# EAGLE schematic 1420-1 (EAGLE 6.0)
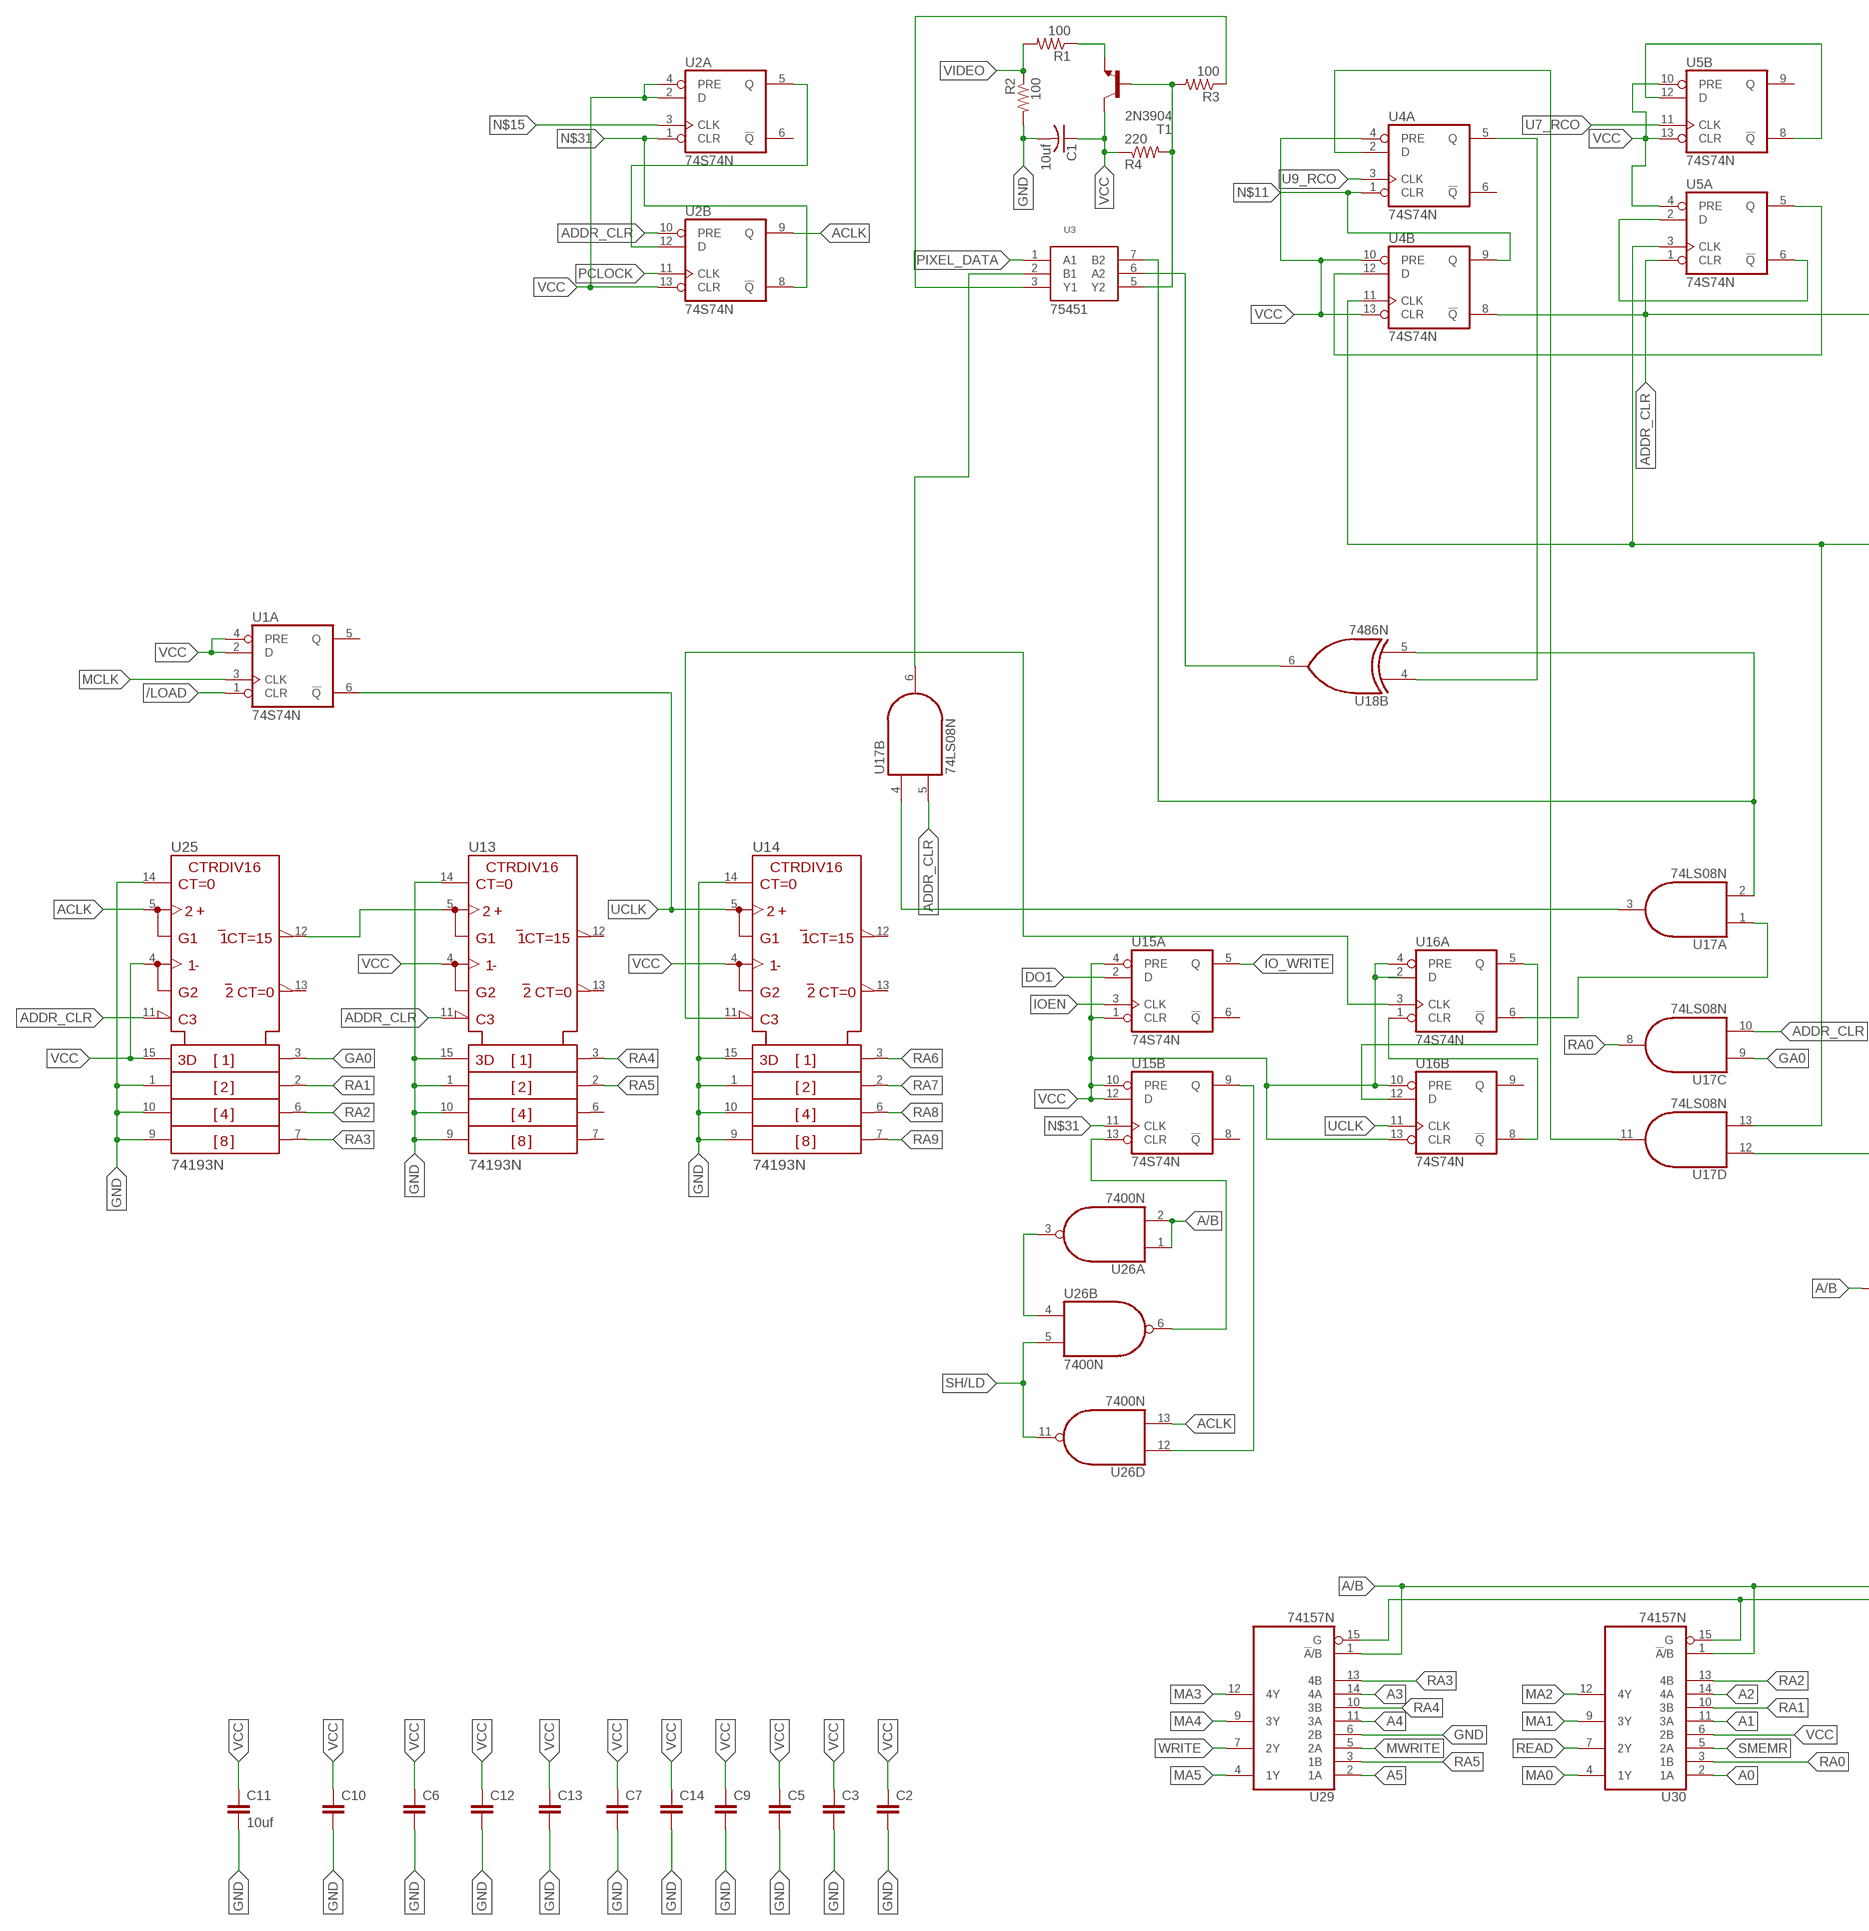
[diagram p0: schematic, sheet 1, part 1 of 2]
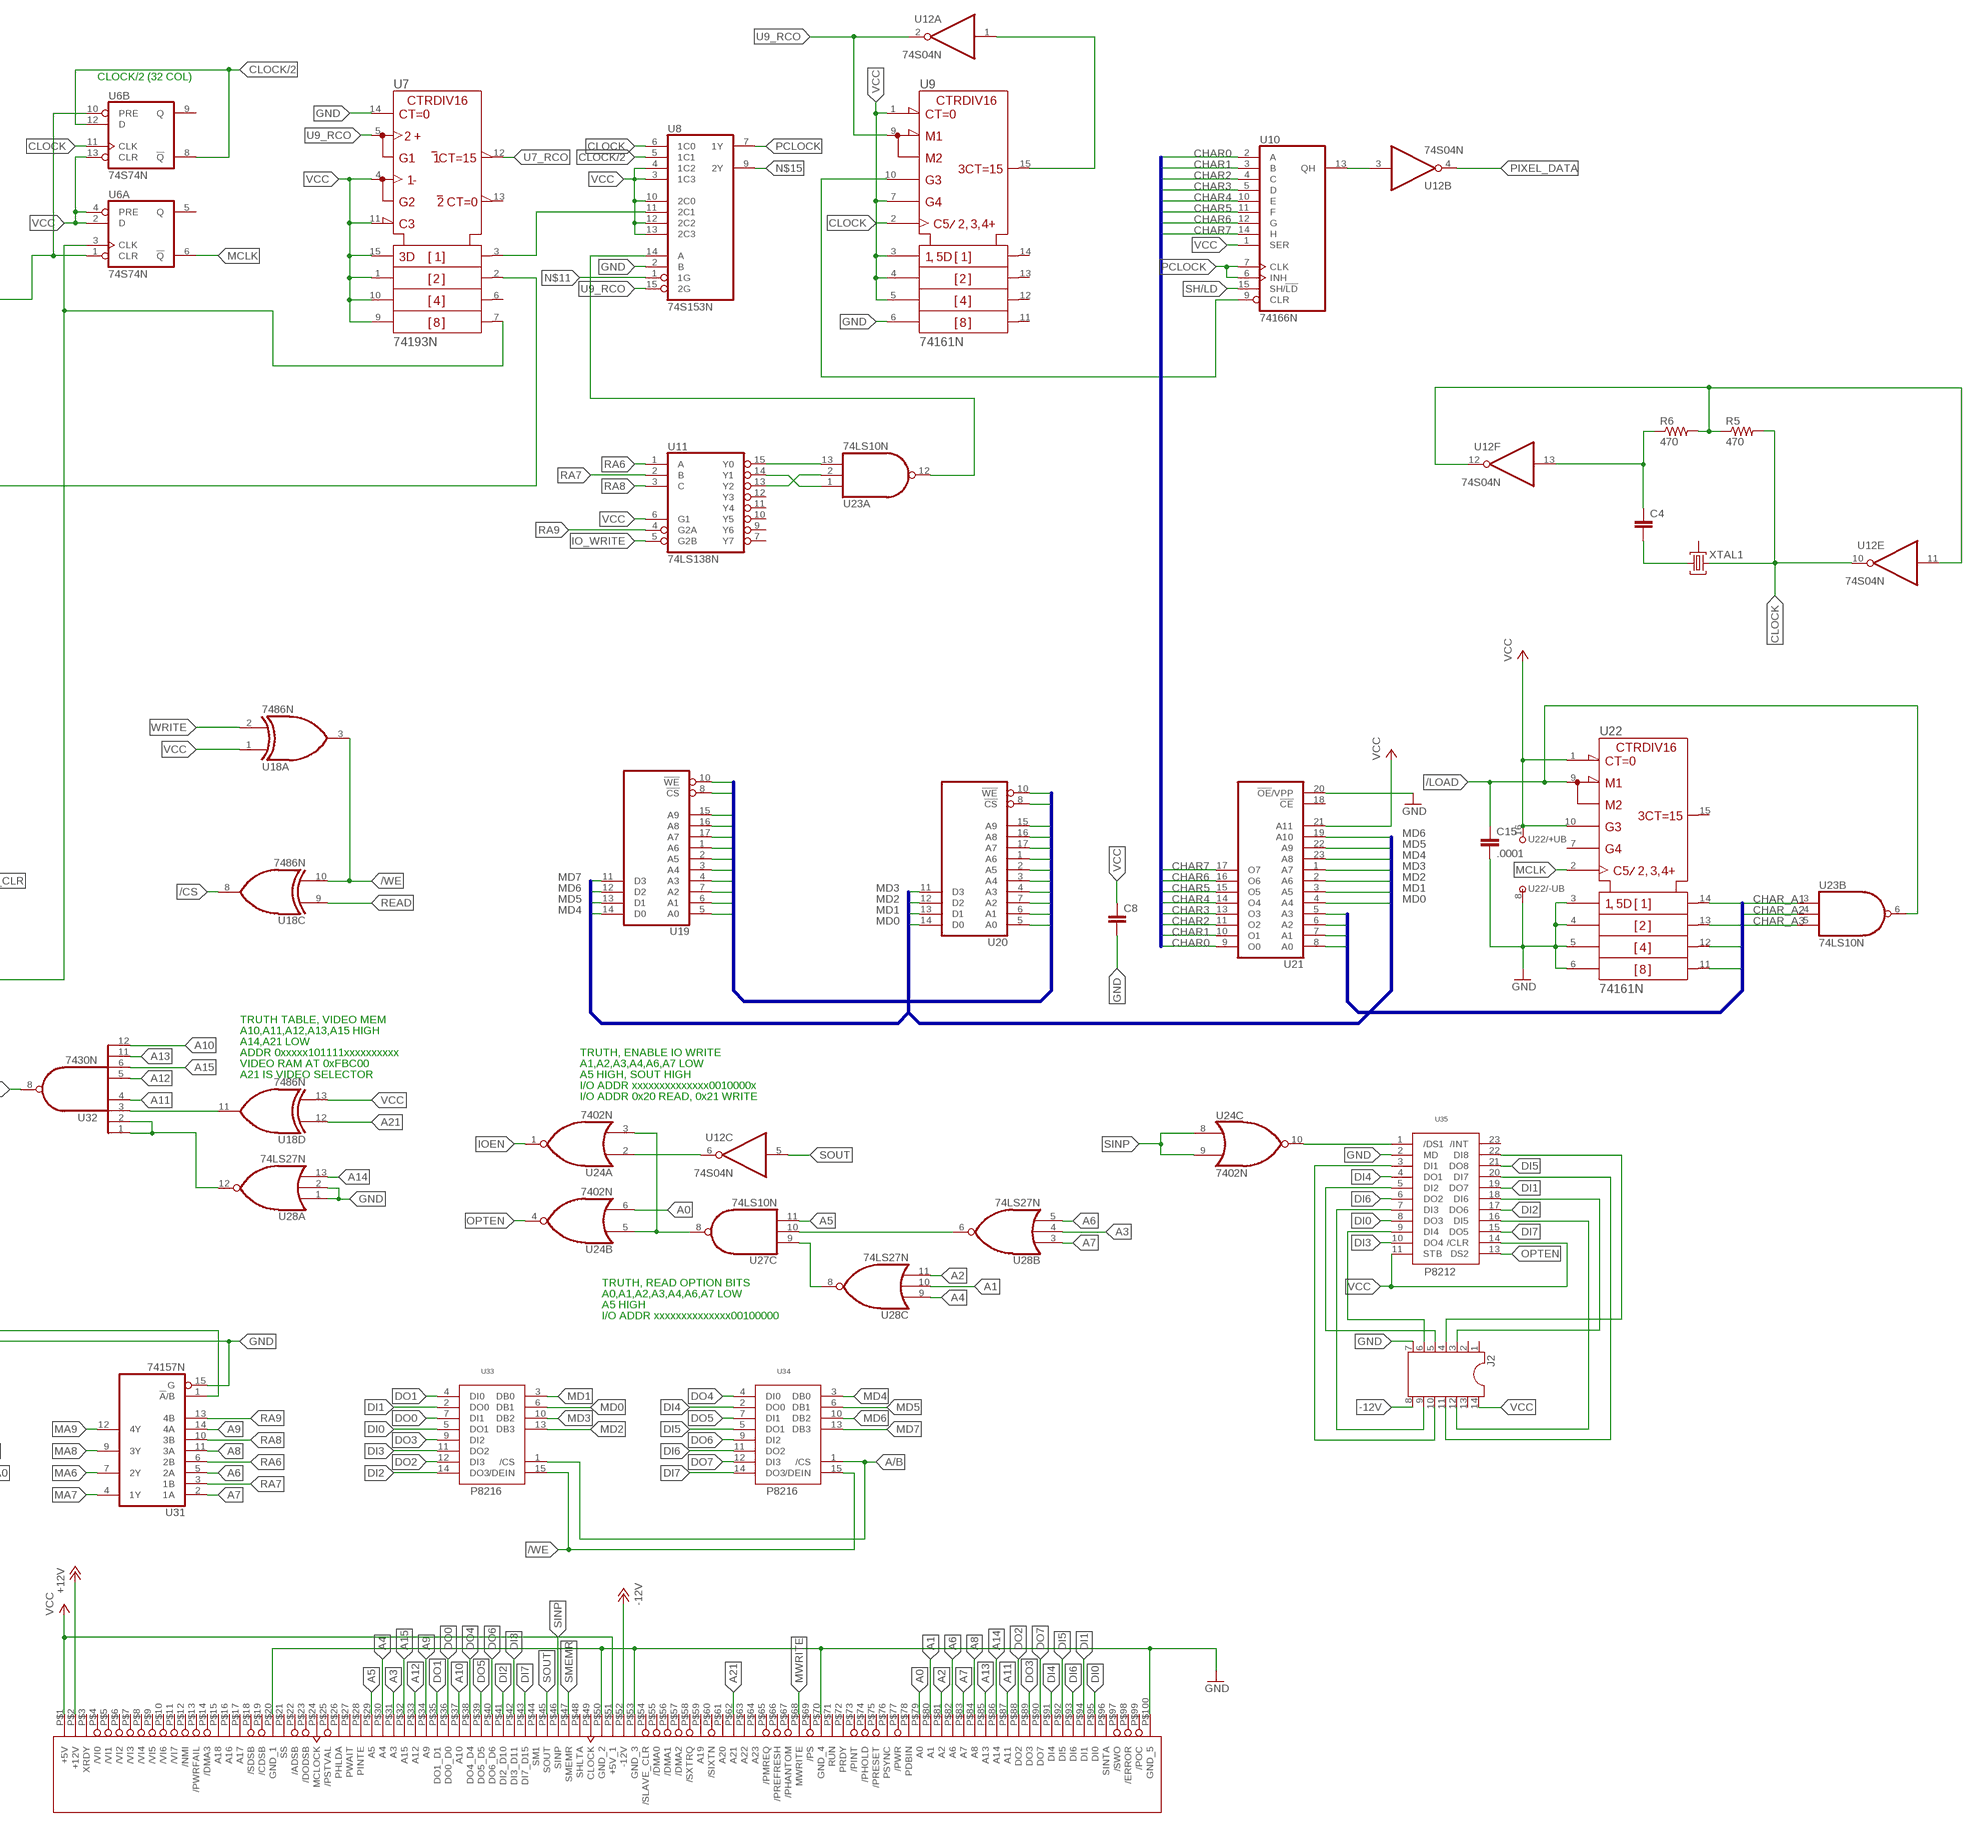
[diagram p1: schematic, sheet 1, part 2 of 2]

## Parts
C1  10uf  C-US075-042X103  [C075-042X103]
C2  C7.5/3  [C7.5B3]
C3  C7.5/3  [C7.5B3]
C4  C7.5/3  [C7.5B3]
C5  C7.5/3  [C7.5B3]
C6  C7.5/3  [C7.5B3]
C7  C7.5/3  [C7.5B3]
C8  C7.5/3  [C7.5B3]
C9  C7.5/3  [C7.5B3]
C10  C7.5/3  [C7.5B3]
C11  10uf  C7.5/3  [C7.5B3]
C12  C7.5/3  [C7.5B3]
C13  C7.5/3  [C7.5B3]
C14  C7.5/3  [C7.5B3]
C15  .0001  C7.5/3  [C7.5B3]
J2  DIL14S  [SOCKET-14]
R1  100  R-US_0207/15  [0207/15]
R2  100  R-US_0207/15  [0207/15]
R3  100  R-US_0207/15  [0207/15]
R4  220  R-US_0207/15  [0207/15]
R5  470  R-US_0207/15  [0207/15]
R6  470  R-US_0207/15  [0207/15]
T1  2N3904  [TO92]
U1  74S74N  [DIL14]
U2  74S74N  [DIL14]
U3  75451  [DIL08]
U4  74S74N  [DIL14]
U5  74S74N  [DIL14]
U6  74S74N  [DIL14]
U7  74193N  [DIL16]
U8  74S153N  [DIL16]
U9  74161N  [DIL16]
U10  74166N  [DIL16]
U11  74LS138N  [DIL16]
U12  74S04N  [DIL14]
U13  74193N  [DIL16]
U14  74193N  [DIL16]
U15  74S74N  [DIL14]
U16  74S74N  [DIL14]
U17  74LS08N  [DIL14]
U18  7486N  [DIL14]
U19  2114  [DIL18]
U20  2114  [DIL18]
U21  2732  [DIL24]
U22  74161N  [DIL16]
U23  74LS10N  [DIL14]
U24  7402N  [DIL14]
U25  74193N  [DIL16]
U26  7400N  [DIL14]
U27  74LS10N  [DIL14]
U28  74LS27N  [DIL14]
U29  74157N  [DIL16]
U30  74157N  [DIL16]
U31  74157N  [DIL16]
U32  7430N  [DIL14]
U33  P8216  [DIL16]
U34  P8216  [DIL16]
U35  P8212  [DIL24-6]
U$1  S100_MALE  [S100_MALE]
XTAL1  HC49TL-H  [HC49TL-H]

## Nets
+12V: U$1.P$2(+12V)
-12V: J2.8 U$1.P$52(-12V)
/A14: U28.12(A:O) U32.1(I0) U32.2(I1)
/CS: U18.8(C:O) U19.8(!CS) U20.8(!CS)
/LOAD: C15.1 U1.1(A:CLR) U22.9(!LOAD) U23.6(B:O)
/WE: U18.3(A:O) U18.10(C:I1) U18.11(D:O) U19.10(!WE) U20.10(!WE) U32.3(I2) U33.15(/DEIN) U34.15(/DEIN)
A0: U24.6(B:I1) U30.2(1A) U$1.P$79(A0)
A1: U28.10(C:I1) U30.11(3A) U$1.P$80(A1)
A2: U28.11(C:I2) U30.14(4A) U$1.P$81(A2)
A3: U28.4(B:I1) U29.14(4A) U$1.P$31(A3)
A4: U28.9(C:I0) U29.11(3A) U$1.P$30(A4)
A5: U27.11(C:I2) U29.2(1A) U$1.P$29(A5)
A6: U28.5(B:I2) U31.5(2A) U$1.P$82(A6)
A7: U28.3(B:I0) U31.2(1A) U$1.P$83(A7)
A8: U31.11(3A) U$1.P$84(A8)
A9: U31.14(4A) U$1.P$34(A9)
A10: U32.12(I7) U$1.P$37(A10)
A11: U32.4(I3) U$1.P$87(A11)
A12: U32.5(I4) U$1.P$33(A12)
A13: U32.11(I6) U$1.P$85(A13)
A14: U28.13(A:I2) U$1.P$86(A14)
A15: U32.6(I5) U$1.P$32(A15)
A21: U18.12(D:I0) U$1.P$62(A21)
A/B: U26.1(A:I0) U26.2(A:I1) U29.1(!A!/B) U30.1(!A!/B) U31.1(!A!/B) U32.8(O) U33.1(/CS) U34.1(/CS)
ACLK: U2.9(B:Q) U25.5(UP) U26.13(D:I1)
ADDR_CLR: U2.10(B:PRE) U4.8(B:!Q) U5.1(A:CLR) U6.1(A:CLR) U6.10(B:PRE) U13.11(!LOAD) U14.11(!LOAD) U16.3(A:CLK) U17.5(B:I1) U17.10(C:I1) U25.11(!LOAD)
CHAR0: U10.2(A) U21.9(O0)
CHAR1: U10.3(B) U21.10(O1)
CHAR2: U10.4(C) U21.11(O2)
CHAR3: U10.5(D) U21.13(O3)
CHAR4: U10.10(E) U21.14(O4)
CHAR5: U10.11(F) U21.15(O5)
CHAR6: U10.12(G) U21.16(O6)
CHAR7: U10.14(H) U21.17(O7)
CHAR_A0: U21.8(A0) U22.14(QA)
CHAR_A1: U21.7(A1) U22.13(QB) U23.3(B:I0)
CHAR_A2: U21.6(A2) U22.12(QC) U23.4(B:I1)
CHAR_A3: U21.5(A3) U22.11(QD) U23.5(B:I2)
CLOCK: R5.2 U6.11(B:CLK) U8.6(1C0) U9.2(CLK) U12.10(E:O) XTAL1.2
CLOCK/2: U6.8(B:!Q) U6.12(B:D) U8.5(1C1)
DI0: U33.5(DO1) U35.8(DO3) U$1.P$95(DI0)
DI1: U33.2(DO0) U35.19(DO7) U$1.P$94(DI1)
DI2: U33.14(DO3) U35.17(DO6) U$1.P$41(DI2_D10)
DI3: U33.11(DO2) U35.10(DO4) U$1.P$42(DI3_D11)
DI4: U34.2(DO0) U35.4(DO1) U$1.P$91(DI4)
DI5: U34.5(DO1) U35.21(DO8) U$1.P$92(DI5)
DI6: U34.11(DO2) U35.6(DO2) U$1.P$93(DI6)
DI7: U34.14(DO3) U35.15(DO5) U$1.P$43(DI7_D15)
DO0: U33.7(DI1) U$1.P$36(DO0_D0)
DO1: U15.2(A:D) U33.4(DI0) U$1.P$35(DO1_D1)
DO2: U33.12(DI3) U$1.P$88(DO2)
DO3: U33.9(DI2) U$1.P$89(DO3)
DO4: U34.4(DI0) U$1.P$38(DO4_D4)
DO5: U34.7(DI1) U$1.P$39(DO5_D5)
DO6: U34.9(DI2) U$1.P$40(DO6_D6)
DO7: U34.12(DI3) U$1.P$90(DO7)
GA0: U17.9(C:I0) U25.3(QA)
GND: C1.2 C2.2 C3.2 C5.2 C6.2 C7.2 C8.2 C9.2 C10.2 C11.2 C12.2 C13.2 C14.2 C15.2 J2.6 J2.7 R2.2 U7.14(CLR) U8.2(B) U9.6(D) U13.1(B) U13.9(D) U13.10(C) U13.14(CLR) U13.15(A) U14.1(B) U14.9(D) U14.10(C) U14.14(CLR) U14.15(A) U21.20(!OE!/VPP) U22.3(A) U22.4(B) U22.5(C) U22.6(D) U22.8(-UB) U25.1(B) U25.9(D) U25.10(C) U25.14(CLR) U28.1(A:I0) U28.2(A:I1) U29.6(2B) U29.15(G) U30.15(G) U31.15(G) U35.2(MD) U35.9(DI4) U$1.P$20(GND_1) U$1.P$50(GND_2) U$1.P$53(GND_3) U$1.P$70(GND_4) U$1.P$100(GND_5)
IO_WRITE: U11.5(G2B) U15.5(A:Q)
IOEN: U15.3(A:CLK) U24.1(A:O)
MA0: U19.5(A0) U20.5(A0) U30.4(1Y)
MA1: U19.6(A1) U20.6(A1) U30.9(3Y)
MA2: U19.7(A2) U20.7(A2) U30.12(4Y)
MA3: U19.4(A3) U20.4(A3) U29.12(4Y)
MA4: U19.3(A4) U20.3(A4) U29.9(3Y)
MA5: U19.2(A5) U20.2(A5) U29.4(1Y)
MA6: U19.1(A6) U20.1(A6) U31.7(2Y)
MA7: U19.17(A7) U20.17(A7) U31.4(1Y)
MA8: U19.16(A8) U20.16(A8) U31.9(3Y)
MA9: U19.15(A9) U20.15(A9) U31.12(4Y)
MCLK: U1.3(A:CLK) U6.6(A:!Q) U22.2(CLK)
MD0: U20.14(D0) U21.4(A4) U33.6(DB1)
MD1: U20.13(D1) U21.3(A5) U33.3(DB0)
MD2: U20.12(D2) U21.2(A6) U33.13(DB3)
MD3: U20.11(D3) U21.1(A7) U33.10(DB2)
MD4: U19.14(D0) U21.23(A8) U34.3(DB0)
MD5: U19.13(D1) U21.22(A9) U34.6(DB1)
MD6: U19.12(D2) U21.19(A10) U34.10(DB2)
MD7: U19.11(D3) U34.13(DB3)
MWRITE: U29.5(2A) U$1.P$68(MWRITE)
N$1: U27.10(C:I1) U28.6(B:O)
N$2: U24.10(C:O) U35.1(/DS1)
N$3: U27.9(C:I0) U28.8(C:O)
N$4: U8.14(A) U23.12(A:O)
N$5: U3.7(B2) U17.2(A:I1) U18.5(B:I1)
N$6: U4.5(A:Q) U18.4(B:I0)
N$7: U12.6(C:O) U24.2(A:I0)
N$9: U10.13(QH) U12.3(B:I)
N$10: U9.15(RCO) U12.1(A:I)
N$11: U4.1(A:CLR) U4.9(B:Q) U8.1(1G)
N$12: U6.3(A:CLK) U7.7(QD) U17.12(D:I0)
N$13: U7.3(QA) U8.11(2C1)
N$15: U2.3(A:CLK) U8.9(2Y)
N$16: R1.1 T1.3(E)
N$17: R3.2 R4.2 T1.2(B) U3.5(Y2)
N$18: R3.1 U3.3(Y1)
N$19: U3.2(B1) U17.6(B:O)
N$20: U3.6(A2) U18.6(B:O)
N$21: U17.3(A:O) U17.4(B:I0)
N$23: U16.6(A:!Q) U17.1(A:I0)
N$24: U5.2(A:D) U5.6(A:!Q)
N$25: U4.11(B:CLK) U5.3(A:CLK) U7.2(QB) U17.13(D:I1)
N$26: U11.15(Y0) U23.13(A:I2)
N$27: U4.2(A:D) U17.11(D:O)
N$29: U13.5(UP) U25.12(!CO)
N$30: U2.5(A:Q) U2.12(B:D)
N$31: U2.1(A:CLR) U2.8(B:!Q) U15.11(B:CLK)
N$32: C4.1 R6.1 U12.13(F:I)
N$33: J2.9 U35.7(DI3)
N$34: J2.5 U35.5(DI2)
N$35: J2.10 U35.3(DI1)
N$36: J2.12 U35.16(DI5)
N$37: J2.3 U35.18(DI6)
N$38: J2.11 U35.20(DI7)
N$39: J2.4 U35.22(DI8)
N$40: R5.1 R6.2 U12.11(E:I) U12.12(F:O)
N$41: C4.2 XTAL1.1
N$42: U24.3(A:I1) U24.5(B:I0) U27.8(C:O)
N$43: U26.3(A:O) U26.4(B:I0)
N$44: U15.13(B:CLR) U26.6(B:O)
N$45: U11.13(Y2) U23.2(A:I1)
N$46: U15.9(B:Q) U26.12(D:I0)
N$47: U11.14(Y1) U23.1(A:I0)
N$48: U9.10(ENT) U10.9(CLR)
N$49: U5.8(B:!Q) U5.12(B:D)
N$51: U4.12(B:D) U5.5(A:Q)
N$52: U16.1(A:CLR) U16.8(B:!Q)
N$53: U16.5(A:Q) U16.12(B:D)
OPTEN: U24.4(B:O) U35.13(DS2)
PCLOCK: U2.11(B:CLK) U8.7(1Y) U10.6(INH) U10.7(CLK)
PIXEL_DATA: U3.1(A1) U12.4(B:O)
RA0: U17.8(C:O) U30.3(1B)
RA1: U25.2(QB) U30.10(3B)
RA2: U25.6(QC) U30.13(4B)
RA3: U25.7(QD) U29.13(4B)
RA4: U13.3(QA) U29.10(3B)
RA5: U13.2(QB) U29.3(1B)
RA6: U11.1(A) U14.3(QA) U31.6(2B)
RA7: U11.2(B) U14.2(QB) U31.3(1B)
RA8: U11.3(C) U14.6(QC) U31.10(3B)
RA9: U11.4(G2A) U14.7(QD) U31.13(4B)
READ: U18.9(C:I0) U30.7(2Y)
SH/LD: U10.15(SH/!LD) U26.5(B:I1) U26.11(D:O)
SINP: U24.8(C:I0) U24.9(C:I1) U$1.P$46(SINP)
SMEMR: U30.5(2A) U$1.P$47(SMEMR)
SOUT: U12.5(C:I) U$1.P$45(SOUT)
U7_RCO: U5.11(B:CLK) U7.12(!CO)
U9_RCO: U4.3(A:CLK) U7.5(UP) U8.15(2G) U9.9(!LOAD) U12.2(A:O)
UCLK: U1.6(A:!Q) U14.5(UP) U16.11(B:CLK)
VCC: C1.1 C2.1 C3.1 C5.1 C6.1 C7.1 C8.1 C9.1 C10.1 C11.1 C12.1 C13.1 C14.1 J2.14 R4.1 T1.1(C) U1.2(A:D) U1.4(A:PRE) U2.2(A:D) U2.4(A:PRE) U2.13(B:CLR) U4.4(A:PRE) U4.10(B:PRE) U4.13(B:CLR) U5.4(A:PRE) U5.10(B:PRE) U5.13(B:CLR) U6.2(A:D) U6.4(A:PRE) U6.13(B:CLR) U7.1(B) U7.4(DOWN) U7.9(D) U7.10(C) U7.11(!LOAD) U7.15(A) U8.3(1C3) U8.4(1C2) U8.10(2C0) U8.12(2C2) U8.13(2C3) U9.1(!CLR) U9.3(A) U9.4(B) U9.5(C) U9.7(ENP) U10.1(SER) U11.6(G1) U13.4(DOWN) U14.4(DOWN) U15.1(A:CLR) U15.4(A:PRE) U15.10(B:PRE) U15.12(B:D) U16.4(A:PRE) U16.10(B:PRE) U16.13(B:CLR) U18.1(A:I0) U18.13(D:I1) U21.21(A11) U22.1(!CLR) U22.10(ENT) U22.16(+UB) U25.4(DOWN) U25.15(A) U30.6(2B) U35.11(STB) U35.14(/CLR) U$1.P$1(+5V) U$1.P$51(+5V_1)
VIDEO: R1.2 R2.1
WRITE: U18.2(A:I1) U29.7(2Y)
Unconnected: J2.1 J2.2 J2.13 U1.5(A:Q) U1.8(B:!Q) U1.9(B:Q) U1.10(B:PRE) U1.11(B:CLK) U1.12(B:D) U1.13(B:CLR) U2.6(A:!Q) U4.6(A:!Q) U5.9(B:Q) U6.5(A:Q) U6.9(B:Q) U7.6(QC) U7.13(!BO) U9.11(QD) U9.12(QC) U9.13(QB) U9.14(QA) U11.7(Y7) U11.9(Y6) U11.10(Y5) U11.11(Y4) U11.12(Y3) U12.8(D:O) U12.9(D:I) U13.6(QC) U13.7(QD) U13.12(!CO) U13.13(!BO) U14.12(!CO) U14.13(!BO) U15.6(A:!Q) U15.8(B:!Q) U16.2(A:D) U16.9(B:Q) U21.18(!CE) U22.7(ENP) U22.15(RCO) U23.8(C:O) U23.9(C:I0) U23.10(C:I1) U23.11(C:I2) U24.11(D:I0) U24.12(D:I1) U24.13(D:O) U25.13(!BO) U26.8(C:O) U26.9(C:I0) U26.10(C:I1) U27.1(A:I0) U27.2(A:I1) U27.3(B:I0) U27.4(B:I1) U27.5(B:I2) U27.6(B:O) U27.12(A:O) U27.13(A:I2) U35.23(/INT) U$1.P$3(XRDY) U$1.P$4(/VI0) U$1.P$5(/VI1) U$1.P$6(/VI2) U$1.P$7(/VI3) U$1.P$8(/VI4) U$1.P$9(/VI5) U$1.P$10(/VI6) U$1.P$11(/VI7) U$1.P$12(/NMI) U$1.P$13(/PWRFAIL) U$1.P$14(/DMA3) U$1.P$15(A18) U$1.P$16(A16) U$1.P$17(A17) U$1.P$18(/SDSB) U$1.P$19(/CDSB) U$1.P$21(SS) U$1.P$22(/ADSB) U$1.P$23(/DODSB) U$1.P$24(MCLOCK) U$1.P$25(/PSTVAL) U$1.P$26(PHLDA) U$1.P$27(PWAIT) U$1.P$28(PINTE) U$1.P$44(SM1) U$1.P$48(SHLTA) U$1.P$49(CLOCK) U$1.P$54(/SLAVE_CLR) U$1.P$55(/DMA0) U$1.P$56(/DMA1) U$1.P$57(/DMA2) U$1.P$58(/SXTRQ) U$1.P$59(A19) U$1.P$60(/SIXTN) U$1.P$61(A20) U$1.P$63(A22) U$1.P$64(A23) U$1.P$65(/PMREQ) U$1.P$66(/PREFRESH) U$1.P$67(/PHANTOM) U$1.P$69(/PS) U$1.P$71(RUN) U$1.P$72(PRDY) U$1.P$73(/PINT) U$1.P$74(/PHOLD) U$1.P$75(/PRESET) U$1.P$76(PSYNC) U$1.P$77(/PWR) U$1.P$78(PDBIN) U$1.P$96(SINTA) U$1.P$97(/SWO) U$1.P$98(/ERROR) U$1.P$99(/POC) XTAL1.3

## Buses
MA[0..11],/CS,/WE
MD[0..7]
CHAR[0..7]
CHAR_A[0..3]

## Notes on the sheet
- CLOCK/2 (32 COL)
- TRUTH TABLE, VIDEO MEM
- A10,A11,A12,A13,A15 HIGH
- A14,A21 LOW
- ADDR 0xxxxx101111xxxxxxxxxx | TRUTH, ENABLE IO WRITE
- VIDEO RAM AT 0xFBC00 | A1,A2,A3,A4,A6,A7 LOW
- A21 IS VIDEO SELECTOR | A5 HIGH, SOUT HIGH
- I/O ADDR xxxxxxxxxxxxxx0010000x
- I/O ADDR 0x20 READ, 0x21 WRITE
- TRUTH, READ OPTION BITS
- A0,A1,A2,A3,A4,A6,A7 LOW
- A5 HIGH
- I/O ADDR xxxxxxxxxxxxxx00100000

## Power pins joined to a net without a drawn wire
+UB: U7.16(+UB) U9.16(+UB) U13.16(+UB) U14.16(+UB) U25.16(+UB)
-UB: U7.8(-UB) U9.8(-UB) U13.8(-UB) U14.8(-UB) U25.8(-UB)
GND: U1.7(P:GND) U2.7(P:GND) U3.4(GND) U4.7(P:GND) U5.7(P:GND) U6.7(P:GND) U8.8(GND) U10.8(GND) U11.8(GND) U12.7(P:GND) U15.7(P:GND) U16.7(P:GND) U17.7(P:GND) U18.7(P:GND) U19.9(GND) U20.9(GND) U21.12(GND) U23.7(P:GND) U24.7(P:GND) U26.7(P:GND) U27.7(P:GND) U28.7(P:GND) U29.8(GND) U30.8(GND) U31.8(GND) U32.7(GND) U33.8(GND) U34.8(GND) U35.12(GND)
VCC: U1.14(P:VCC) U2.14(P:VCC) U3.8(VCC) U4.14(P:VCC) U5.14(P:VCC) U6.14(P:VCC) U8.16(VCC) U10.16(VCC) U11.16(VCC) U12.14(P:VCC) U15.14(P:VCC) U16.14(P:VCC) U17.14(P:VCC) U18.14(P:VCC) U19.18(VCC) U20.18(VCC) U21.24(VCC) U23.14(P:VCC) U24.14(P:VCC) U26.14(P:VCC) U27.14(P:VCC) U28.14(P:VCC) U29.16(VCC) U30.16(VCC) U31.16(VCC) U32.14(VCC) U33.16(VCC) U34.16(VCC) U35.24(VCC)

## Library data of the parts
C1 = resistor:C-US: CAPACITOR, American symbol
C2-C15 = capacitor-wima:C: CAPACITOR naming: grid - package width
J2 = ic-package:DIL14: Dual In Line / Socket
R1-R6 = resistor:R-US_: RESISTOR, American symbol
T1 = transistor:2N3904: NPN TRANSISTOR
U1 U2 U4-U6 U15 U16 = 74xx-us:74*74: Dual D type positive edge triggered FLIP FLOP, preset and clear
U3 = s100:75451
U7 U13 U14 U25 = 74ttl-din:74*193: Synchronus 4-bit up down COUNTER
U8 = 74xx-us:74*153: Dual 4-line to 1-line data SELECTOR/MULTIPLEXER
U9 U22 = 74ttl-din:74*161: Synchrounus 4-bit COUNTER
U10 = 74xx-us:74*166: 8-bit parallel load SHIFT REGISTER
U11 = 74xx-us:74*138: 3-line to 8-line DECODER/DEMULTIPLEXER
U12 = 74xx-us:74*04: Hex INVERTER
U17 = 74xx-us:74*08: Quad 2-input AND gate
U18 = 74xx-us:74*86: Quad 2-input EXCLUSIV-OR (XOR) gate
U19 U20 = memory:2114: MEMORY
U21 = memory:2732: MEMORY
U23 U27 = 74xx-us:74*10: Triple 3-input NAND gate
U24 = 74xx-us:74*02: Quad 2-input NOR gate
U26 = 74xx-us:74*00: Quad 2-input NAND gate
U28 = 74xx-us:74*27: Triple 3-input NOR gate
U29-U31 = 74xx-us:74*157: Quadruple 2-line to 1-line data SELECTOR/MULTIPLEXER
U32 = 74xx-us:74*30: 8-input NAND gate
U33 U34 = s100:P8216
U35 = s100:P8212
U$1 = s100:S100_MALE
XTAL1 = crystal:HC49TL-H: CRYSTAL; OC_FARNELL: unknown; OC_NEWARK: unknown